# EAGLE design EL-100-020-005-indicator-light (EAGLE 6.6.0)
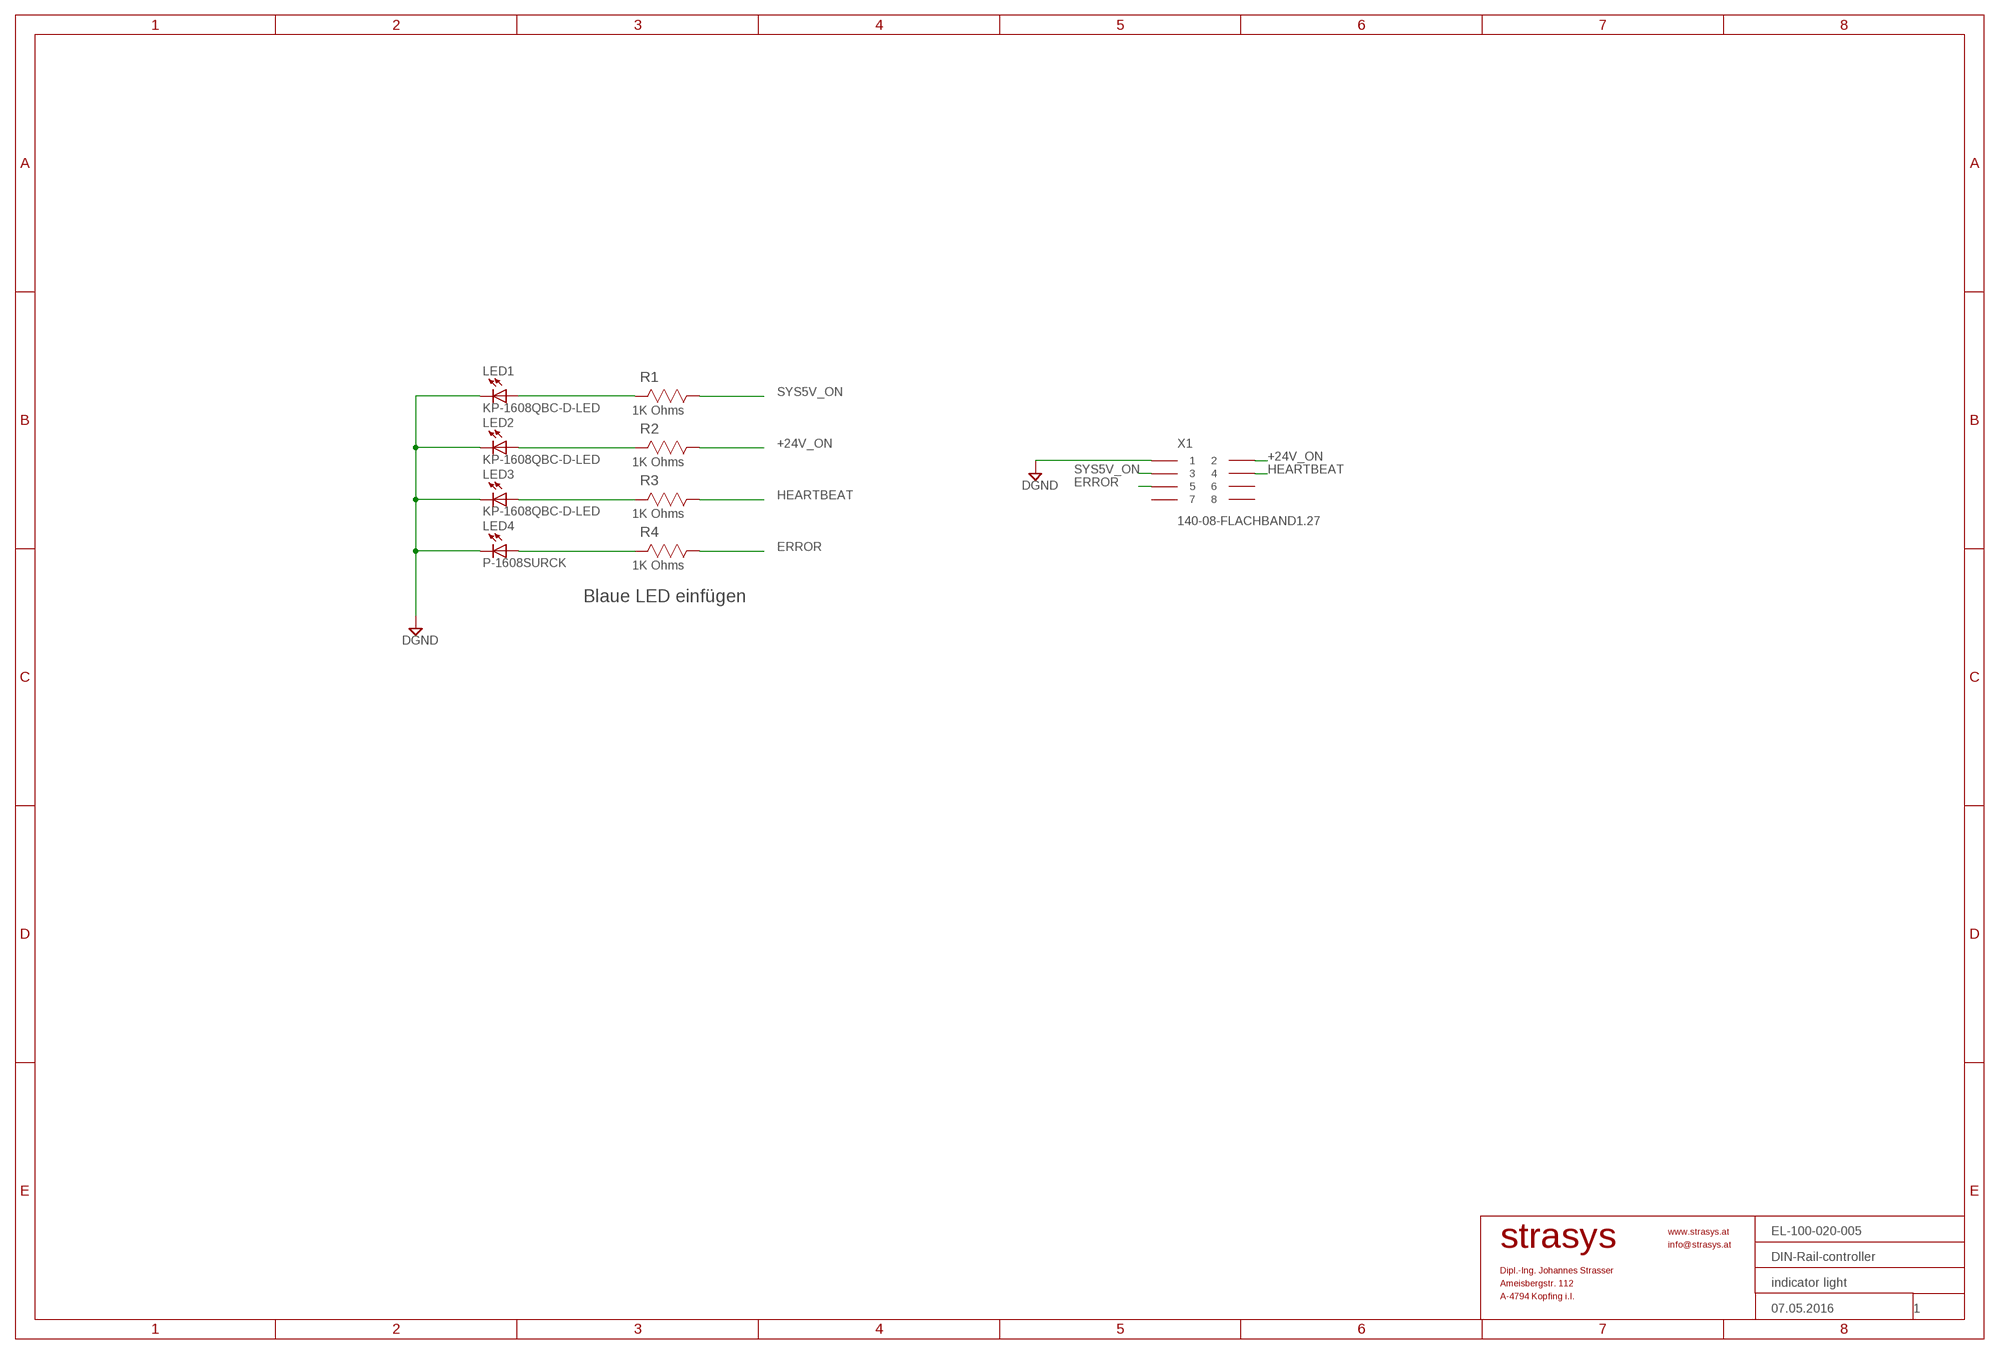
[diagram p0: schematic, sheet 1]
FRAME1 (A3L-LOC): DATE_DRAWING: 07.05.2016; DRAWING_NAME1: DIN-Rail-controller; DRAWING_NAME2: indicator light; DRAWING_NO: EL-100-020-005; PAGE: 1

## Parts
LED1  KP-1608QBC-D-LED  [KP-1608QBCD-D-LED]
LED2  KP-1608QBC-D-LED  [KP-1608QBCD-D-LED]
LED3  KP-1608QBC-D-LED  [KP-1608QBCD-D-LED]
LED4  P-1608SURCK  KP-1608QBC-D-LED  [KP-1608QBCD-D-LED]
R1  1K Ohms  CRCW08051K00JNEA  [RESC2013X65N]
R2  1K Ohms  CRCW08051K00JNEA  [RESC2013X65N]
R3  1K Ohms  CRCW08051K00JNEA  [RESC2013X65N]
R4  1K Ohms  CRCW08051K00JNEA  [RESC2013X65N]
X1  140-08-FLACHBAND1.27  [2,54_2X8]

## Nets
+24V_ON: R2.1 X1.P2
DGND: LED1.2 LED2.2 LED3.2 LED4.2 X1.P1
ERROR: R4.1 X1.P5
HEARTBEAT: R3.1 X1.P4
N$2: LED1.1 R1.2
N$3: LED2.1 R2.2
N$4: LED3.1 R3.2
N$5: LED4.1 R4.2
SYS5V_ON: R1.1 X1.P3
Unconnected: X1.P6 X1.P7 X1.P8

## Notes on the sheet
- Blaue LED einfügen

## Library data of the parts
LED1-LED3 = strasys_standard:KP-1608QBC-D-LED: KP-1608QBC-D-LED Chip LED SMD Package 0603 BLUE; MPC: KP-1608QBC-D-LED; OC_FARNELL: 2217972; SUPPLIER: Kingbright
LED4 = strasys_standard:KP-1608QBC-D-LED: KP-1608QBC-D-LED Chip LED SMD Package 0603 BLUE; MPC: KP-1608SURCK; OC_FARNELL: 2290329; SUPPLIER: Kingbright
R1-R4 = Vishay_By_element14_Batch_1:CRCW08051K00JNEA: RESISTOR, 0805; MPN: CRCW08051K00JNEA; OC_FARNELL: 1652937; OC_NEWARK: 52K9725; SUPPLIER: Vishay; TOLERANCE: ±5%; WATTAGE: 0.125 W
X1 = strasys_standard:140-08-FLACHBAND1.27: IDC Leiterplattenverbinder RM 2,54 Flachbandkabel 1,27 mm

## Board
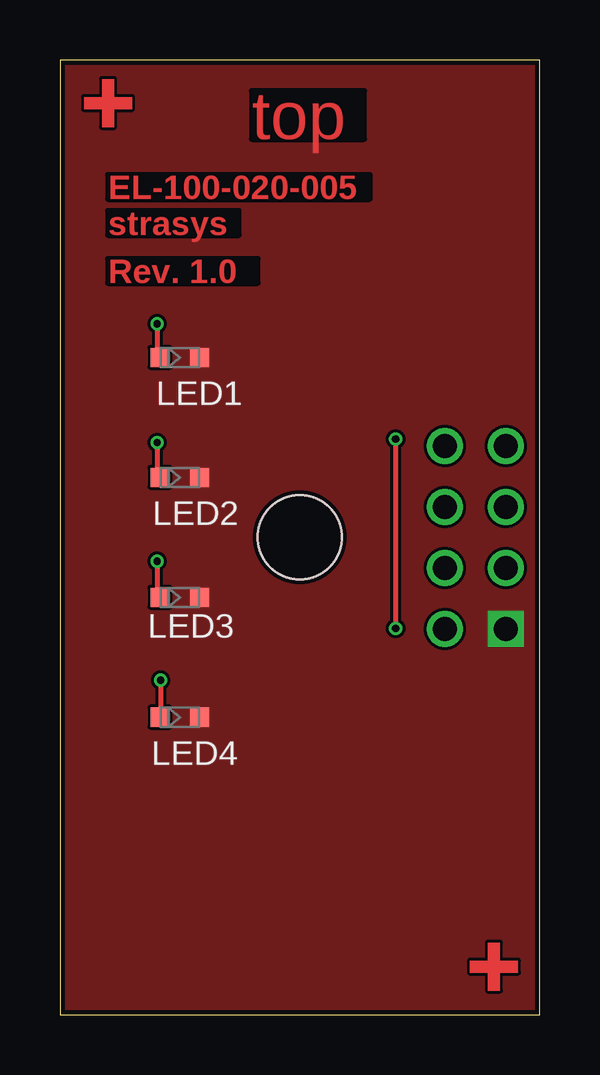
[diagram p1: board, top side]
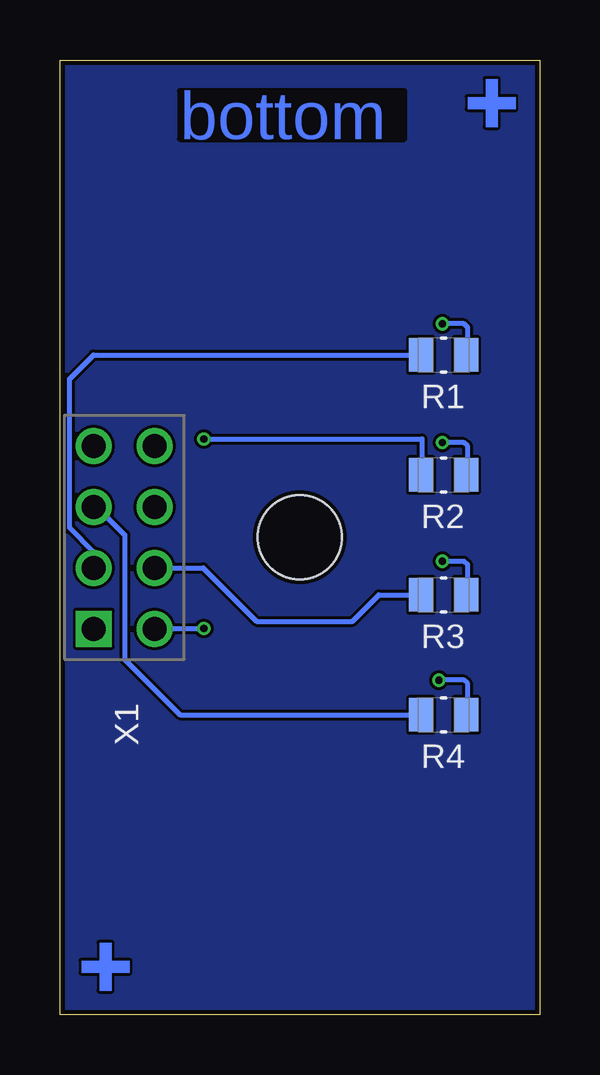
[diagram p2: board, bottom side, seen from below]

Size 20 x 39.8 mm. Coordinates in mm from the lower left corner, seen from the top.
Outline: 0,0 20,0 20,39.8 0,39.8 0,0
Copper layers (1*16): Top 0.018mm / dielectric 1.55mm / Bottom 0.018mm
Design rules "Multi-CB_2L_125um-Tracks_OL35um": minimum track width 0.125mm, minimum drill 0.2mm, track to track 0.125mm, track to pad 0.125mm, pad to pad 0.125mm, via to via 0.125mm, smd to smd 0mil, copper to edge 0.2mm, drill to drill 0.2mm, minimum pad ring 0.125mm, minimum via ring 0.125mm, stop-mask expansion 2mil, vias tented up to drill 0.45mm, thermal gap 0.2mm
Holes 3.5 mm at 10,19.9
tKeepout: area 6.5,16.5 to 13.5,23.5
bKeepout: area 6.5,16.5 to 13.5,23.5

### Footprints (pad centres in the part's own frame; a part is rotated, then mirrored left to right if it is on the bottom)
KP-1608QBCD-D-LED = smd 0.8 x 0.8: 1 -0.825,0; 2 0.825,0
RESC2013X65N = smd 1.016 x 1.397: 1 -0.94,0; 2 0.94,0
2,54_2X8 = drill 1 square: P1 0,0 | drill 1: P2 0,-2.54; P3 2.54,0; P4 2.54,-2.54; P5 5.08,0; P6 5.08,-2.54; P7 7.62,0; P8 7.62,-2.54

### Placement (x,y rotation side)
LED1  5,27.4 0 top
LED2  5,22.4 0 top
LED3  5,17.4 0 top
LED4  5,12.4 0 top
R1  4,27.5 0 bottom
R2  4,22.5 0 bottom
R3  4,17.5 0 bottom
R4  4,12.5 0 bottom
U$1  [PASSER_SMD4]  2,38 0 top
U$2  [PASSER_SMD4]  18.1,2 0 top
U$3  [PASSER_SMD4]  2,38 0 bottom
U$4  [PASSER_SMD4]  18.1,2 0 bottom
X1  18.59,16.09 90 bottom

### Tracks (layer width: path | path; a pad name or v marks a point on that pad's centre or on a via)
+24V_ON  (via drill 0.3)
  Top 0.2: v14,16.1 v14,24
  Bottom 0.2: v14,16.1 16,16.1 X1.P2 | v14,24 4.9,24 4.9,22.5 R2.1
DGND
  pour Top (rank 2, no thermals): 0,39.8 20,39.8 20,0 0,0
ERROR
  Bottom 0.2: X1.P5 18.47,21.17 17.3,20 17.3,14.8 15,12.5 R4.1
HEARTBEAT
  Bottom 0.2: X1.P4 14.03,18.63 11.8,16.4 7.8,16.4 6.7,17.5 R3.1
N$2  (via drill 0.3)
  Top 0.2: v4.05,28.8 4.05,27.6 LED1.1
  Bottom 0.2: v4.05,28.8 3.15,28.8 3,28.65 3,27.6 R1.2
N$3  (via drill 0.3)
  Top 0.2: v4.05,23.85 4.05,22.5 LED2.1
  Bottom 0.2: v4.05,23.85 3.15,23.85 3,23.7 3,22.5 R2.2
N$4  (via drill 0.3)
  Top 0.2: v4.05,18.9 4.05,17.55 LED3.1
  Bottom 0.2: v4.05,18.9 3.15,18.9 3,18.75 3,17.55 R3.2
N$5  (via drill 0.3)
  Top 0.2: v4.2,13.95 4.2,12.6 LED4.1
  Bottom 0.2: v4.2,13.95 3.15,13.95 3,13.8 3,12.6 R4.2
PE
  pour Bottom (rank 6, no thermals): 0,39.8 20,39.8 20,0 0,0
SYS5V_ON
  Bottom 0.2: X1.P3 18.59,19.29 19.6,20.3 19.6,26.5 18.6,27.5 R1.1

### Text on the board
Top: top | EL-100-020-005 | strasys | Rev. 1.0
Bottom: bottom